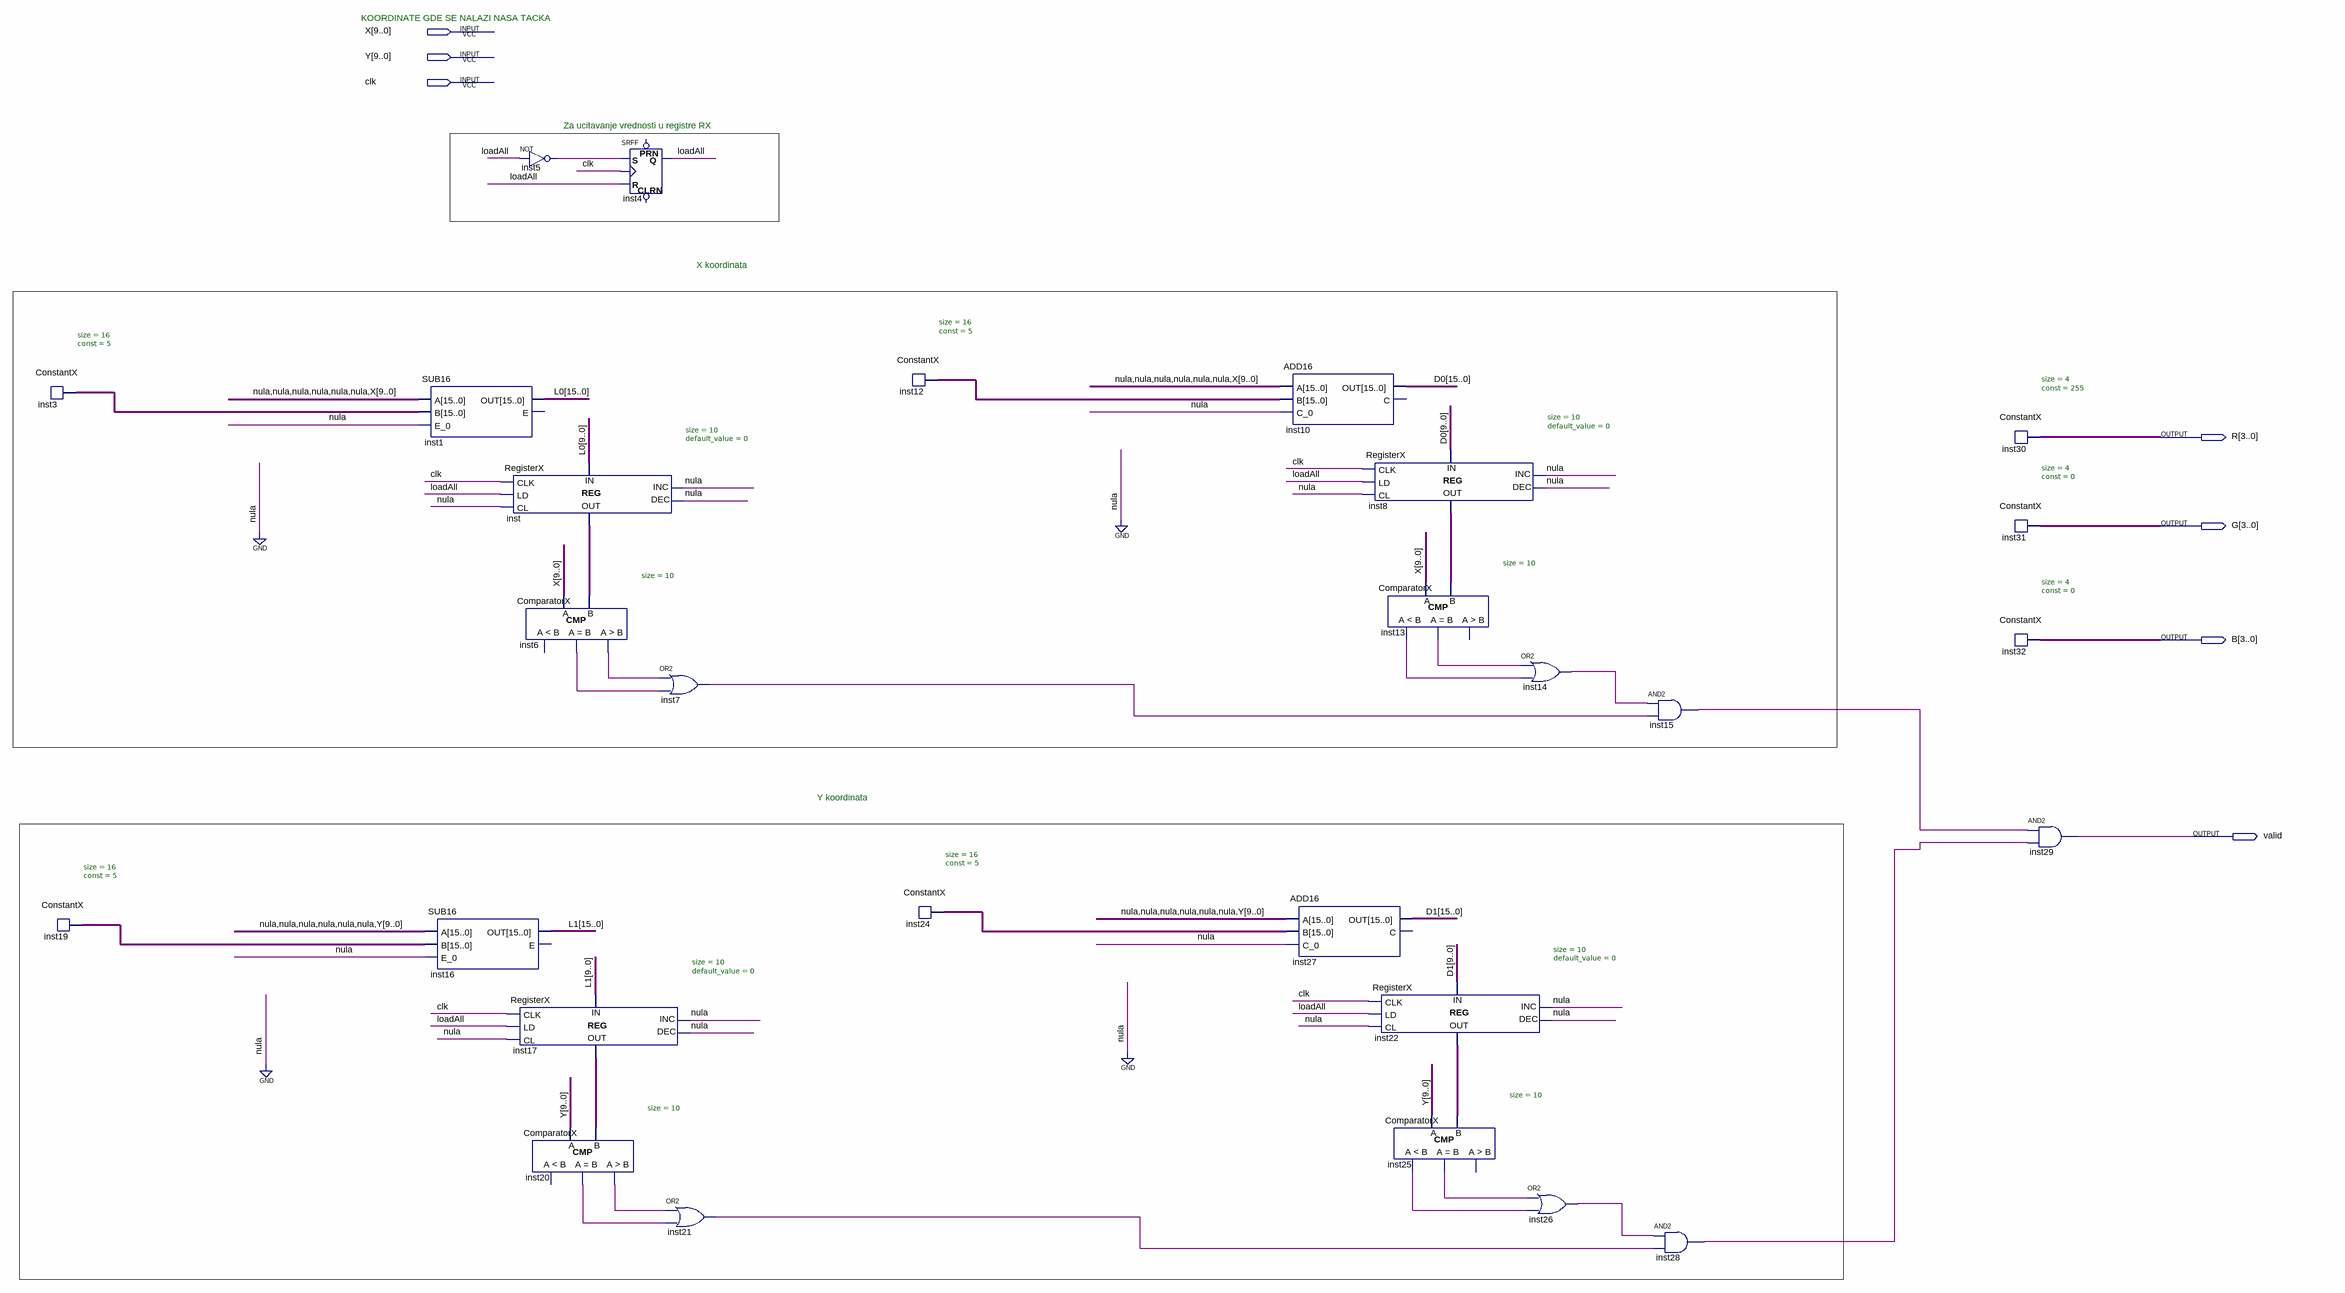
[diagram p0: schematic sheet]
// Quartus schematic Point.bdf as structural Verilog: 28 symbols, 7 pins
module Point (
  input  [9:0] X,
  input  [9:0] Y,
  input  clk,
  output [3:0] R,
  output [3:0] G,
  output [3:0] B,
  output valid
);

  wire inst5_out, inst6_eq, inst6_gr, inst7_out, inst13_eq, inst13_ls, inst14_out, inst15_out, inst20_eq,
       inst20_gr, inst21_out, inst25_eq, inst25_ls, inst26_out, inst28_out, loadAll;
  wire [9:0] inst8_data_out, inst17_data_out, inst22_data_out, inst_data_out;
  wire [15:0] D0, D1, inst3_data_out, inst12_data_out, inst19_data_out, inst24_data_out, L0, L1;

  ConstantX #(.size(16), .\const (5)) inst3 (.DATA_OUT(inst3_data_out));
  ConstantX #(.size(16), .\const (5)) inst19 (.DATA_OUT(inst19_data_out));
  SUB16 inst1 (.A({{6{1'b0}}, X}), .B(inst3_data_out), .E_0(1'b0), .OUT(L0));  // open: E
  SUB16 inst16 (.A({{6{1'b0}}, Y}), .B(inst19_data_out), .E_0(1'b0), .OUT(L1));  // open: E
  not inst5 (inst5_out, loadAll);
  RegisterX #(.size(10), .default_value(0)) inst (
    .CLK(clk), .LD(loadAll), .CL(1'b0), .INC(1'b0), .DEC(1'b0), .DATA_IN(L0[9:0]), .DATA_OUT(inst_data_out));
  ComparatorX #(.size(10)) inst6 (.A(X), .B(inst_data_out), .EQ(inst6_eq), .GR(inst6_gr));  // open: LS
  RegisterX #(.size(10), .default_value(0)) inst17 (
    .CLK(clk), .LD(loadAll), .CL(1'b0), .INC(1'b0), .DEC(1'b0), .DATA_IN(L1[9:0]), .DATA_OUT(inst17_data_out));
  ComparatorX #(.size(10)) inst20 (.A(Y), .B(inst17_data_out), .EQ(inst20_eq), .GR(inst20_gr));  // open: LS
  SRFF inst4 (.S(inst5_out), .R(loadAll), .CLK(clk), .Q(loadAll));  // open: PRN, CLRN
  or inst7 (inst7_out, inst6_gr, inst6_eq);
  or inst21 (inst21_out, inst20_gr, inst20_eq);
  ConstantX #(.size(16), .\const (5)) inst12 (.DATA_OUT(inst12_data_out));
  ConstantX #(.size(16), .\const (5)) inst24 (.DATA_OUT(inst24_data_out));
  ADD16 inst10 (.A({{6{1'b0}}, X}), .B(inst12_data_out), .C_0(1'b0), .OUT(D0));  // open: C
  ADD16 inst27 (.A({{6{1'b0}}, Y}), .B(inst24_data_out), .C_0(1'b0), .OUT(D1));  // open: C
  RegisterX #(.size(10), .default_value(0)) inst8 (
    .CLK(clk), .LD(loadAll), .CL(1'b0), .INC(1'b0), .DEC(1'b0), .DATA_IN(D0[9:0]), .DATA_OUT(inst8_data_out));
  ComparatorX #(.size(10)) inst13 (.A(X), .B(inst8_data_out), .LS(inst13_ls), .EQ(inst13_eq));  // open: GR
  RegisterX #(.size(10), .default_value(0)) inst22 (
    .CLK(clk), .LD(loadAll), .CL(1'b0), .INC(1'b0), .DEC(1'b0), .DATA_IN(D1[9:0]), .DATA_OUT(inst22_data_out));
  ComparatorX #(.size(10)) inst25 (.A(Y), .B(inst22_data_out), .LS(inst25_ls), .EQ(inst25_eq));  // open: GR
  or inst14 (inst14_out, inst13_eq, inst13_ls);
  or inst26 (inst26_out, inst25_eq, inst25_ls);
  and inst15 (inst15_out, inst14_out, inst7_out);
  and inst28 (inst28_out, inst26_out, inst21_out);
  ConstantX #(.size(4), .\const (255)) inst30 (.DATA_OUT(R));
  ConstantX #(.size(4), .\const (0)) inst31 (.DATA_OUT(G));
  ConstantX #(.size(4), .\const (0)) inst32 (.DATA_OUT(B));
  and inst29 (valid, inst15_out, inst28_out);

  // Notes on the sheet:
  //   KOORDINATE GDE SE NALAZI NASA TACKA
  //   Za ucitavanje vrednosti u registre RX
  //   X koordinata
  //   Y koordinata
endmodule
